# Altium schematic sheet SensorSGP30.SchDoc
size A4; Engineer: Kayann Soares; SheetNumber: 6; SheetTotal: 10; CompanyInfo1: Universidade Federal do Ceará; CompanyInfo2: Centro de Tecnologia - CT; CompanyInfo3: Dep. de Eng. de Teleinformática
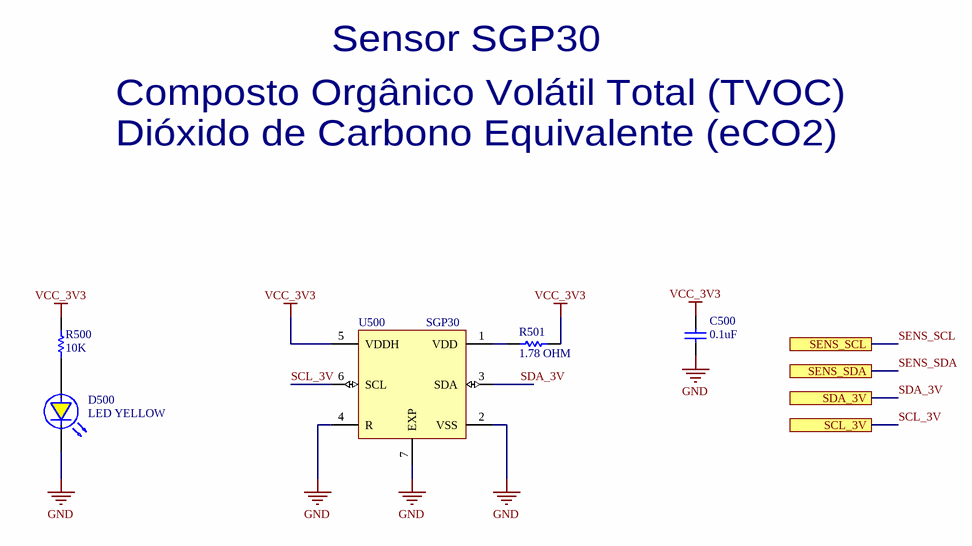
[diagram p0: SensorSGP30.SchDoc]

## Parts
C500  0.1uF  [CAP_CER_0603]
D500  LED YELLOW  [LED_YELLOW_SMD_0603]
R500  10K  [RES_0603]
R501  1.78 OHM  [RES_0603]
U500  SGP30  [SGP30]

## Ports
SCL_3V, SDA_3V, SENS_SCL, SENS_SDA

## Nets
GND: C500.1 D500.K U500.2(VSS) U500.4(R) U500.7(EXP)
VCC_3V3: C500.2 R500.2 R501.2 U500.5(VDDH)
SCL_3V: U500.6(SCL) ; port SCL_3V
SDA_3V: U500.3(SDA) ; port SDA_3V
SENS_SCL: port SENS_SCL
SENS_SDA: port SENS_SDA
NetD500_A: D500.A R500.1
NetR501_1: R501.1 U500.1(VDD)

## Notes on the sheet
- Sensor SGP30
- Composto Orgânico Volátil Total (TVOC)
- Dióxido de Carbono Equivalente (eCO2)
- Título:
- Padrão:
- Projeto:
- Eng. Responsável:
- A4
- Data:
- Versão:
- Folha:
- V1
- de
- Arquivo:

## Library data of the parts
C500 = CAP_CER_0.1uF_0603: Supplier 1: Digi-Key Marketplace; Supplier Part Number 1: 2571-GMC10X7R104J25NTTR-ND
D500 = LED_YELLOW_SMD_0603: Supplier 1: Digi-Key; Supplier Part Number 1: 754-1124-1-ND
R500 = RES_10K_0603: Supplier 1: Digi-Key Marketplace; Supplier Part Number 1: 2571-RM06J103CTTR-ND
R501 = RES_1.78OHM_0603: Supplier 1: Arrow Electronics; Supplier Part Number 1: RMCF0603FT1R78
U500 = SGP30: Supplier 1: Digi-Key; Supplier Part Number 1: 1649-1084-1-ND